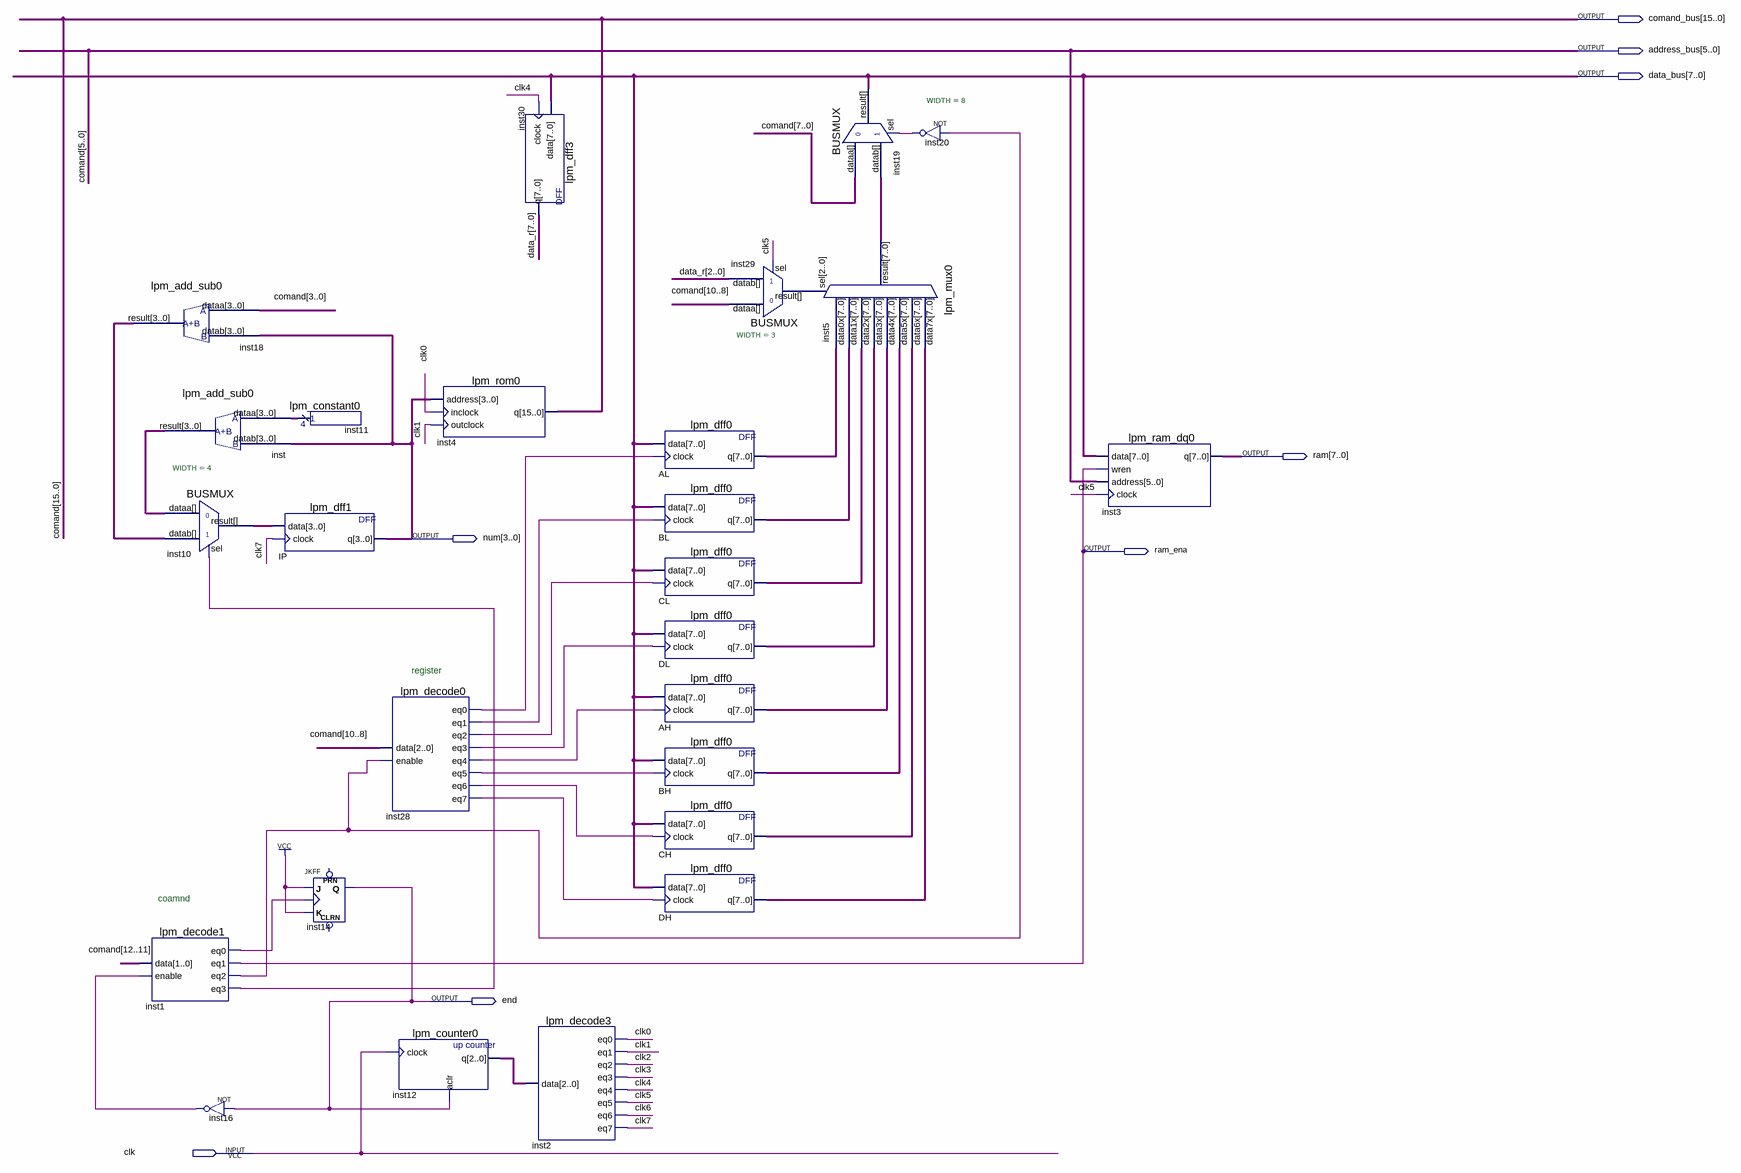
[diagram p0: schematic sheet]
// Quartus schematic Block1.bdf as structural Verilog: 26 symbols, 8 pins
module Block1 (
  input  clk,
  output [15:0] comand_bus,
  output [5:0] address_bus,
  output [7:0] data_bus,
  output [7:0] ram,
  output [3:0] num,
  output ram_ena,
  output \end 
);

  wire clk0, clk1, clk2, clk3, clk4, clk5, clk6, clk7, inst1_eq0, inst1_eq2, inst1_eq3, inst16_out,
       inst20_out, inst28_eq0, inst28_eq1, inst28_eq2, inst28_eq3, inst28_eq4, inst28_eq5, inst28_eq6,
       inst28_eq7;
  wire [2:0] inst12_q, inst29_result;
  wire [3:0] inst10_result, inst11_result, inst18_result, inst_result;
  wire [7:0] AH_q, AL_q, BH_q, BL_q, CH_q, CL_q, data_r, DH_q, DL_q, inst5_result;

  lpm_add_sub0 inst18 (.dataa(address_bus[3:0]), .datab(num), .result(inst18_result));
  lpm_decode1 inst1 (
    .data(comand_bus[12:11]), .enable(inst16_out), .eq0(inst1_eq0), .eq1(ram_ena), .eq2(inst1_eq2),
    .eq3(inst1_eq3));
  lpm_add_sub0 inst (.dataa(inst11_result), .datab(num), .result(inst_result));
  BUSMUX #(.WIDTH(4)) inst10 (.datab(inst18_result), .sel(inst1_eq3), .dataa(inst_result), .result(inst10_result));
  not inst16 (inst16_out, \end );
  lpm_constant0 inst11 (.result(inst11_result));
  lpm_dff1 IP (.data(inst10_result), .clock(clk7), .q(num));
  JKFF inst14 (.K(1'b1), .J(1'b1), .CLK(inst1_eq0), .Q(\end ));  // open: PRN, CLRN
  lpm_decode0 inst28 (
    .data(comand_bus[10:8]), .enable(inst1_eq2), .eq0(inst28_eq0), .eq1(inst28_eq1), .eq2(inst28_eq2),
    .eq3(inst28_eq3), .eq4(inst28_eq4), .eq5(inst28_eq5), .eq6(inst28_eq6), .eq7(inst28_eq7));
  lpm_counter0 inst12 (.clock(clk), .aclr(\end ), .q(inst12_q));
  lpm_rom0 inst4 (.address(num), .inclock(clk0), .outclock(clk1), .q({comand_bus[15:6], address_bus}));
  lpm_dff3 inst30 (.data(data_bus), .clock(clk4), .q(data_r));
  lpm_decode3 inst2 (
    .data(inst12_q), .eq0(clk0), .eq1(clk1), .eq2(clk2), .eq3(clk3), .eq4(clk4), .eq5(clk5), .eq6(clk6),
    .eq7(clk7));
  lpm_dff0 AL (.data(data_bus), .clock(inst28_eq0), .q(AL_q));
  lpm_dff0 BL (.data(data_bus), .clock(inst28_eq1), .q(BL_q));
  lpm_dff0 CL (.data(data_bus), .clock(inst28_eq2), .q(CL_q));
  lpm_dff0 DL (.data(data_bus), .clock(inst28_eq3), .q(DL_q));
  lpm_dff0 AH (.data(data_bus), .clock(inst28_eq4), .q(AH_q));
  lpm_dff0 BH (.data(data_bus), .clock(inst28_eq5), .q(BH_q));
  lpm_dff0 CH (.data(data_bus), .clock(inst28_eq6), .q(CH_q));
  lpm_dff0 DH (.data(data_bus), .clock(inst28_eq7), .q(DH_q));
  BUSMUX #(.WIDTH(3)) inst29 (.datab(data_r[2:0]), .sel(clk5), .dataa(comand_bus[10:8]), .result(inst29_result));
  BUSMUX #(.WIDTH(8)) inst19 (
    .datab(inst5_result), .sel(inst20_out), .dataa({comand_bus[7:6], address_bus}), .result(data_bus));
  lpm_mux0 inst5 (
    .data7x(DH_q), .data6x(CH_q), .data5x(BH_q), .data4x(AH_q), .data3x(DL_q), .data2x(CL_q), .data1x(BL_q),
    .data0x(AL_q), .sel(inst29_result), .result(inst5_result));
  not inst20 (inst20_out, inst1_eq2);
  lpm_ram_dq0 inst3 (.data(data_bus), .wren(ram_ena), .address(address_bus), .clock(clk5), .q(ram));

  assign comand_bus[5:0] = address_bus;

  // Other names for the same wires on the sheet: comand[15:0] = {comand_bus[15:6], address_bus}

  // Notes on the sheet:
  //   register
  //   coamnd
endmodule
